# EAGLE design SOT-23_Breakout (EAGLE 8.0.2)
CNAME: Sot-23 Breakout; CREVISION: V1.0; DESIGNER: November Five
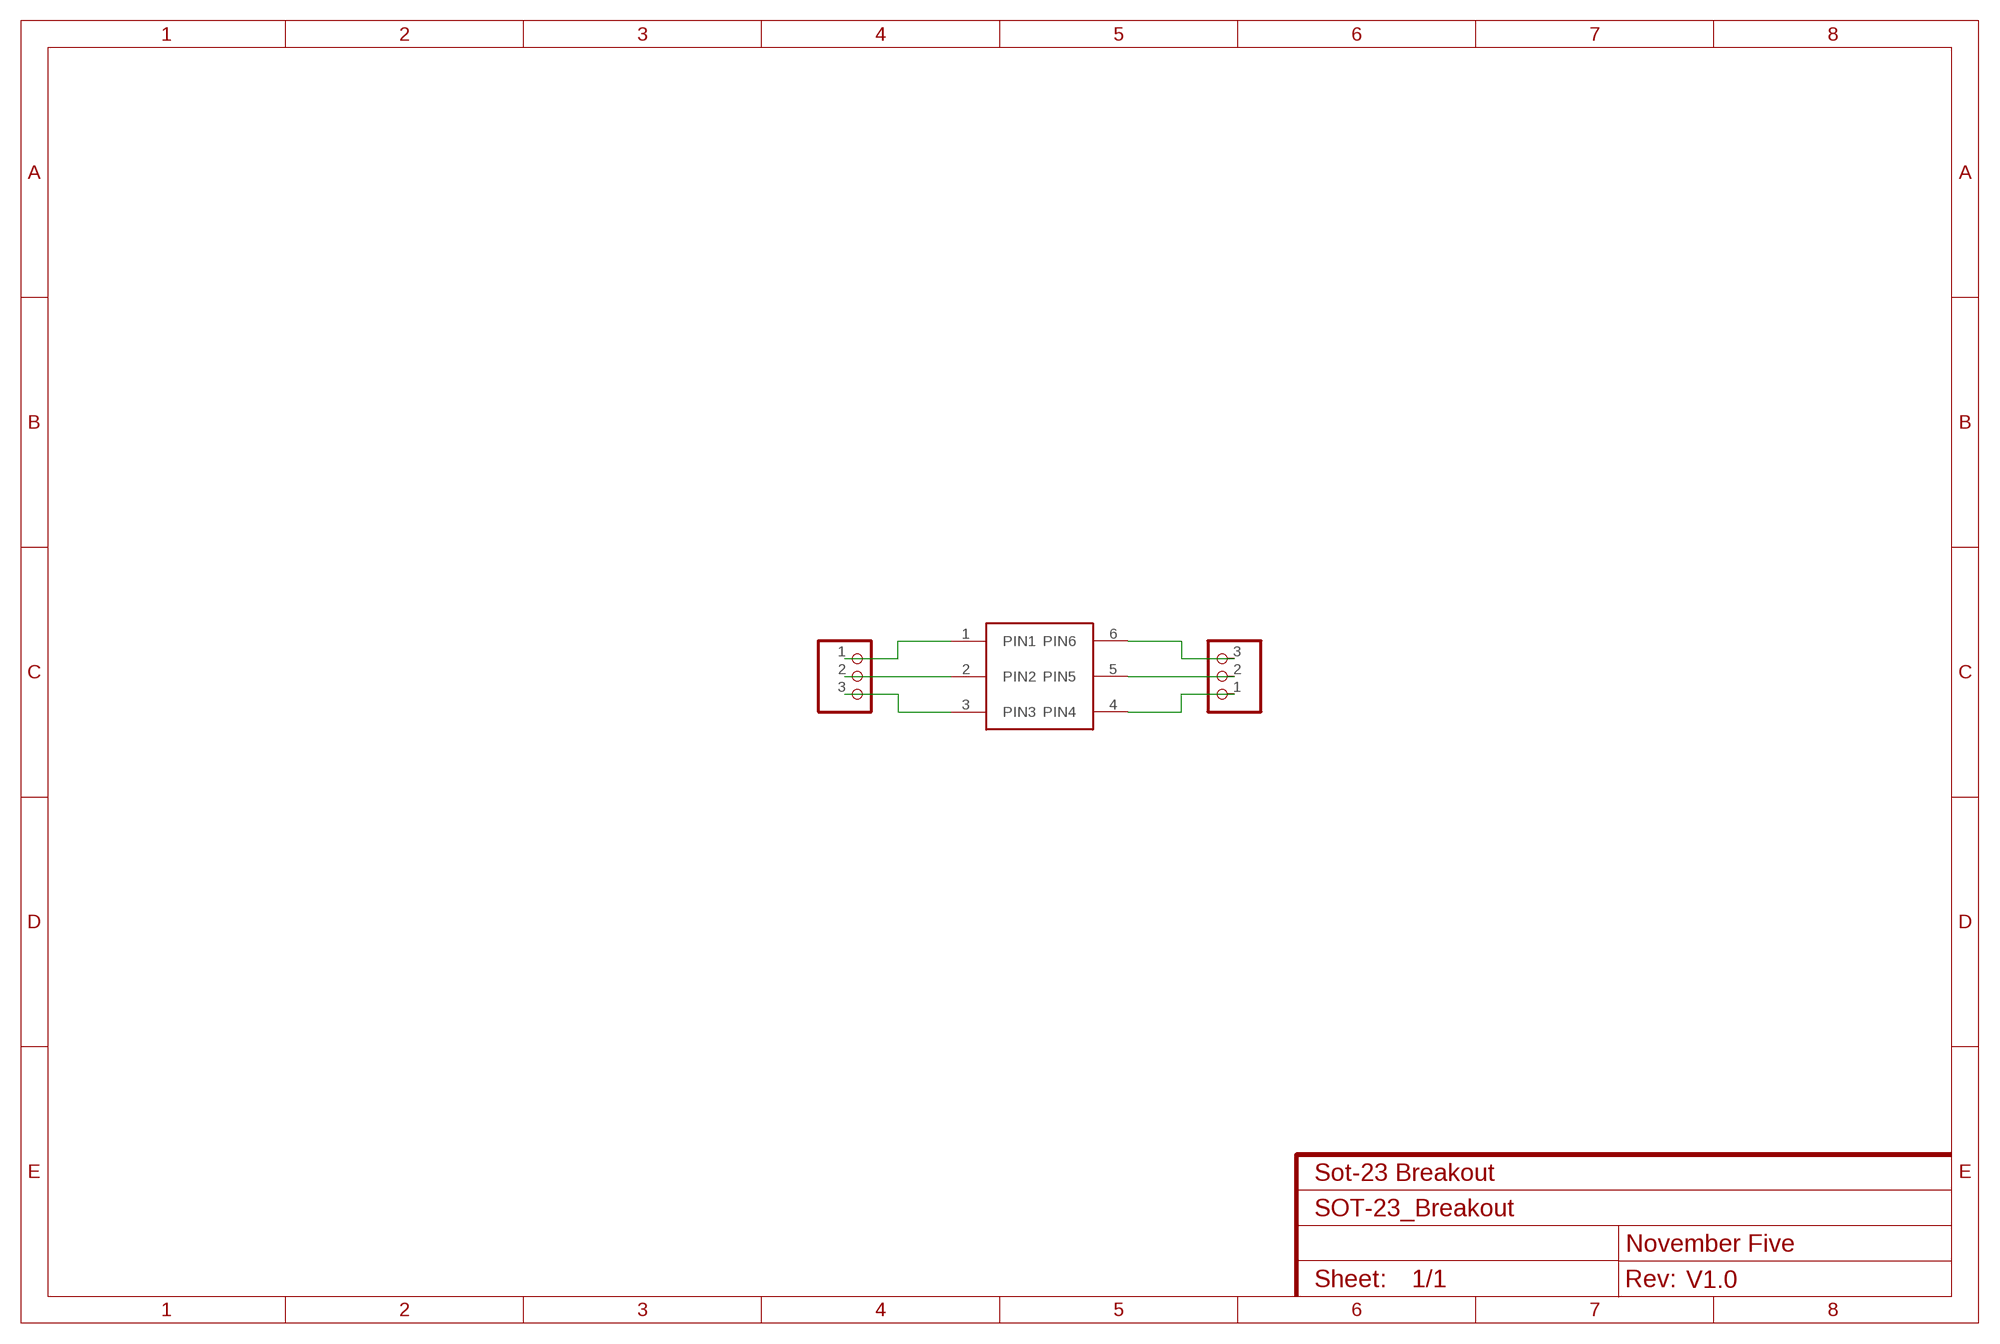
[diagram p0: schematic, sheet 1]

## Parts
.  SOT-23-6  [SOT-23-6]
JP1  PINHD-1X3  [1X03]
JP2  PINHD-1X3  [1X03]

## Nets
N$1: ..1(PIN1) JP1.1
N$2: ..2(PIN2) JP1.2
N$3: ..3(PIN3) JP1.3
N$4: ..6(PIN6) JP2.3
N$5: ..5(PIN5) JP2.2
N$6: ..4(PIN4) JP2.1

## Library data of the parts
. = smd-footprints:SOT-23-6
JP1 JP2 = adafruit:PINHD-1X3: PIN HEADER

## Board
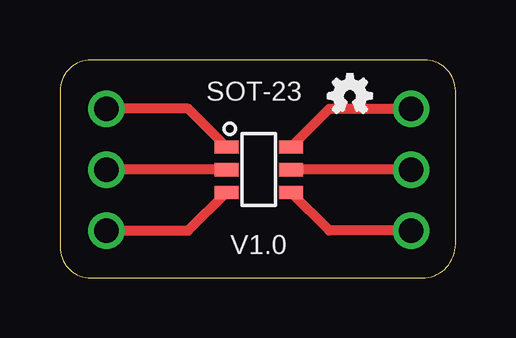
[diagram p1: board, top side]
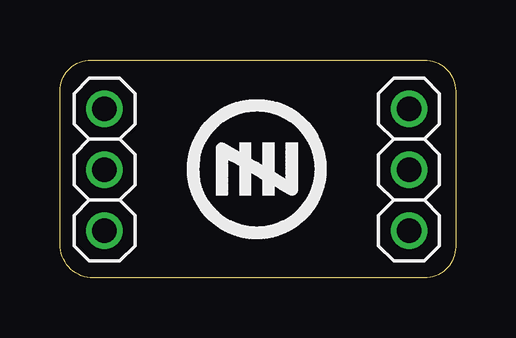
[diagram p2: board, bottom side, seen from below]

Size 16.5 x 9.1 mm. Coordinates in mm from the lower left corner, seen from the top.
Outline: 1.3,9.1 arc90 0,7.8 0,1.3 arc90 1.3,0 15.1,0 arc90 16.5,1.4 16.5,7.8 arc90 15.2,9.1 1.3,9.1
Copper layers (1*16): Top 0.035mm / dielectric 1.5mm / Bottom 0.035mm
Design rules "default": minimum track width 10mil, minimum drill 24mil, track to track 8mil, track to pad 8mil, pad to pad 8mil, via to via 8mil, smd to smd 8mil, copper to edge 40mil, drill to drill 8mil, minimum pad ring 10mil, minimum via ring 8mil, stop-mask expansion 4mil, vias tented up to drill 0mil, thermal gap 10mil

### Footprints (pad centres in the part's own frame; a part is rotated, then mirrored left to right if it is on the bottom)
SOT-23-6 = smd 1 x 0.55: 1 -1.35,0.95; 2 -1.35,0; 3 -1.35,-0.95; 4 1.35,-0.95; 5 1.35,0; 6 1.35,0.95
1X03 = drill 1.016: 1 -2.54,0; 2 0,0; 3 2.54,0

### Placement (x,y rotation side)
.  8.29,4.52 0 top
JP1  1.94,4.52 270 bottom
JP2  14.64,4.52 90 bottom
U$1  [LOGO-OSHWA]  10.9,6.8 0 top
U$2  [LOGO-NOVEMERFIVE-7SCALE]  10.25,1.65 0 top

### Tracks (layer width: path | path; a pad name or v marks a point on that pad's centre or on a via)
N$1
  Top 0.406: ..1 5.35,7.06 JP1.1
N$2
  Top 0.406: ..2 JP1.2
N$3
  Top 0.406: ..3 5.35,1.98 JP1.3
N$4
  Top 0.406: ..6 11.23,7.06 JP2.3
N$5
  Top 0.406: JP2.2 ..5
N$6
  Top 0.406: JP2.1 11.23,1.98 ..4

### Text on the board
tPlace: SOT-23 | V1.0